# EAGLE board projekt_oswietlenia (EAGLE 8.5.2)
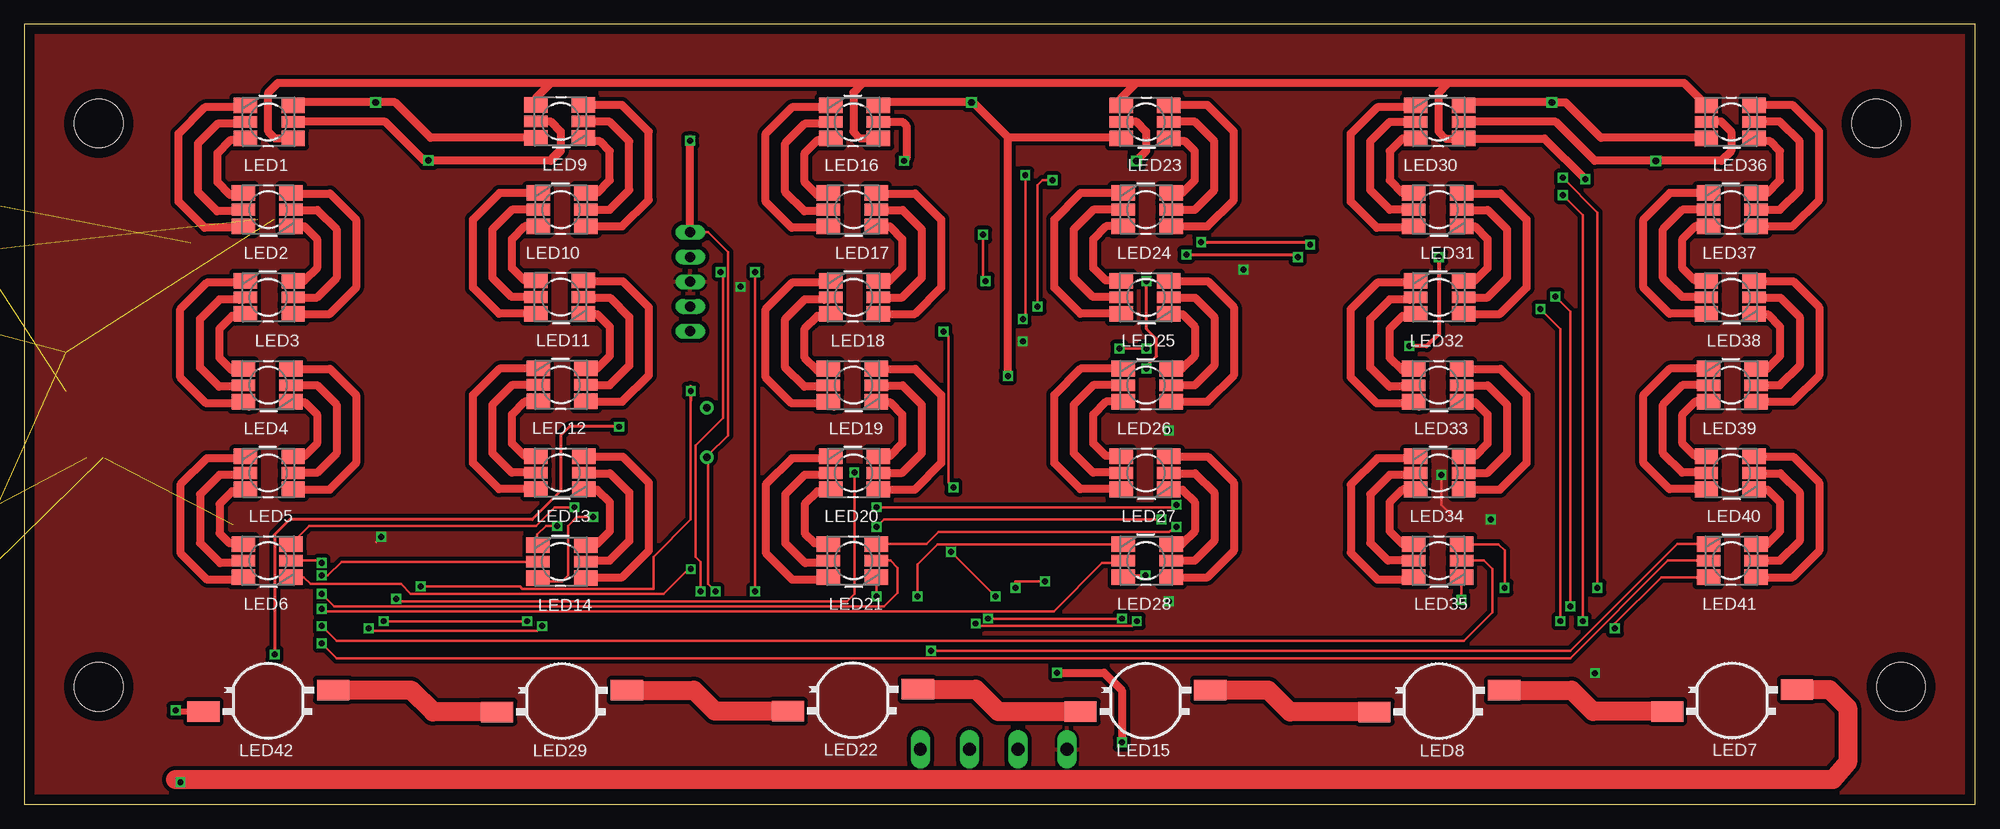
[diagram p3: board, top side]
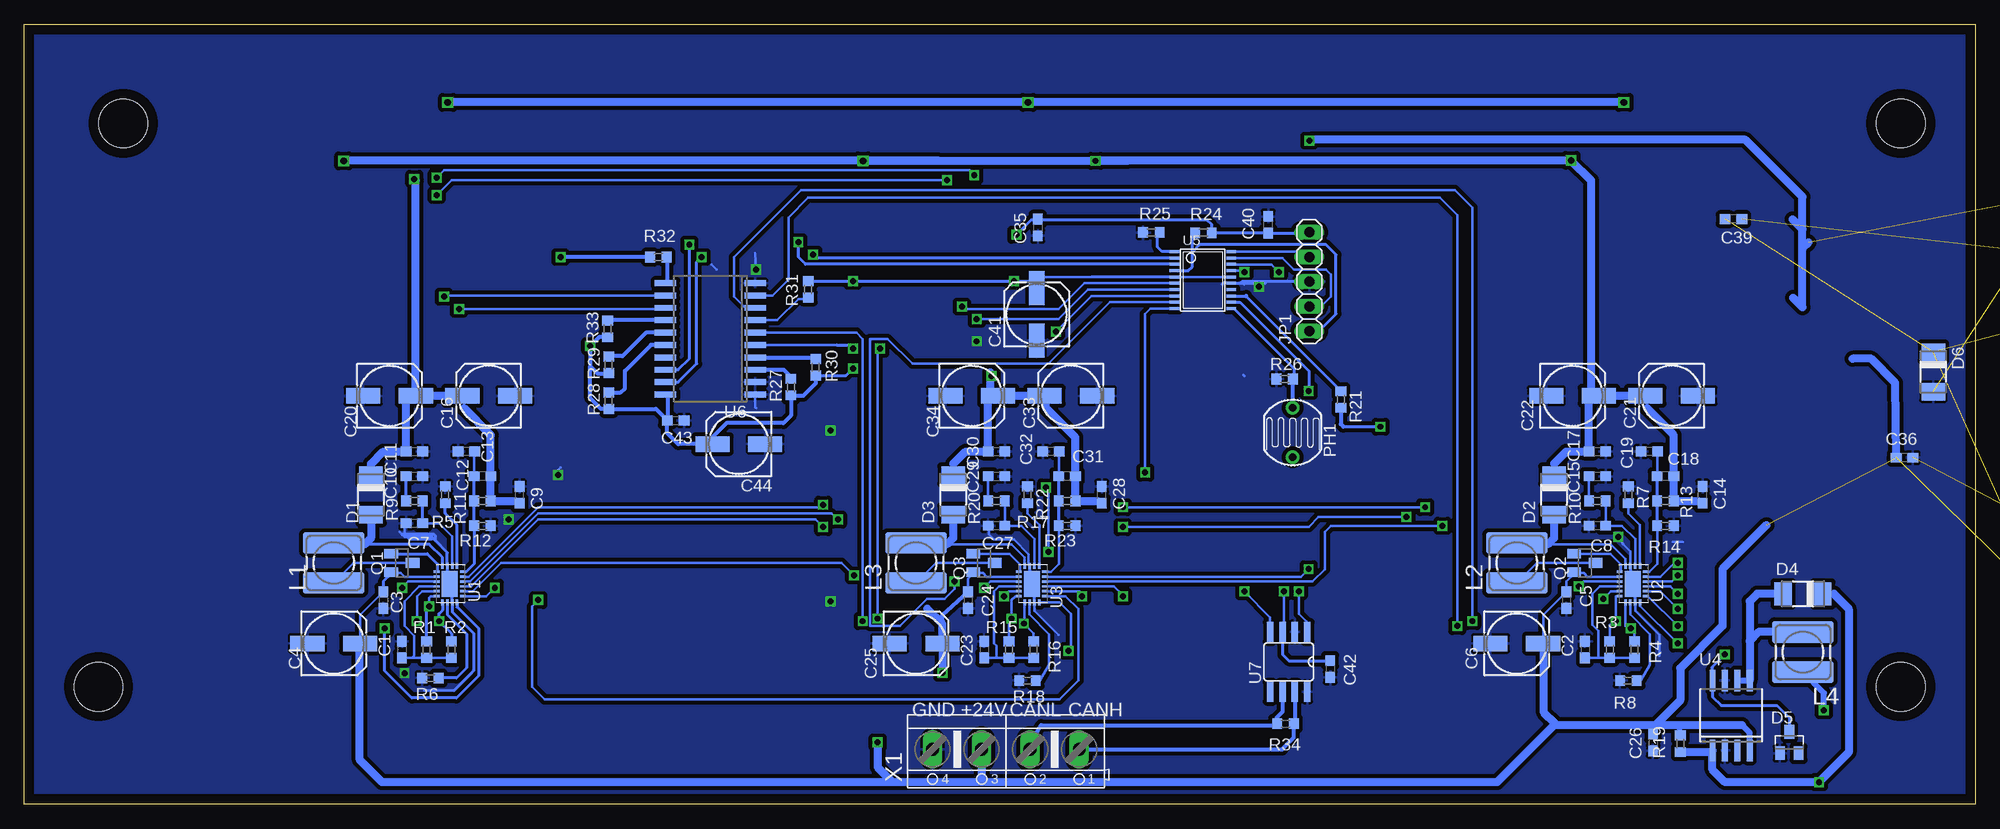
[diagram p4: board, bottom side, seen from below]

Size 200 x 80 mm. Coordinates in mm from the lower left corner, seen from the top.
Outline: 0,0 200,0 200,80 0,80 0,0
Copper layers (1*16): Top 0.035mm / dielectric 1.5mm / Bottom 0.035mm
Design rules "default *": minimum track width 9mil, minimum drill 24mil, track to track 6mil, track to pad 6mil, pad to pad 6mil, via to via 8mil, smd to smd 6mil, copper to edge 40mil, drill to drill 8mil, minimum pad ring 10mil, minimum via ring 8mil, stop-mask expansion 4mil, vias tented up to drill 0mil, thermal gap 10mil
Holes 5 mm at 7.62,69.85 7.62,12.06 192.41,12.06 189.87,69.85

## Footprints (pad centres in the part's own frame; a part is rotated, then mirrored left to right if it is on the bottom)
C0603 = smd 1.1 x 1: 1 -0.85,0; 2 0.85,0
153CLV-0605 = smd 3.5 x 1.6: + 2.7,0; - -2.7,0
DO-214AC = smd 1.8 x 2.4: A 2.025,0; C -2.025,0
SOT23 = smd 1 x 1.4: 1 -0.95,-1.1; 2 0.95,-1.1; 3 0,1.1
SMB = smd 2.4 x 2.4: A 2.2,0; C -2.2,0
SOT23-6 = smd 0.6 x 0.9: 1 -0.95,-1.15; 2 0,-1.15; 3 0.95,-1.15; 4 0.95,1.15; 5 0,1.15; 6 -0.95,1.15
1X05 = drill 1.016 long: 1 -5.08,0; 2 -2.54,0; 3 0,0; 4 2.54,0; 5 5.08,0
POWER-CHOKE_WE-TPC = smd 6.3 x 2.2: 1 0,2.05; 2 0,-2.05
MS50 = smd 2.8 x 1.4: 1 0,-1.7; 2 0,1.7
OVSTRGBBCR8 = smd 2.4 x 1.6: 1 2.342,-1.7; 3 2.342,1.7; 4 -2.558,1.7; 6 -2.558,-1.7 | smd 2.4 x 1.2: 2 2.342,0; 5 -2.558,0
Z-POWER-LED-DOME-TYPE = smd 3.3 x 2.1: A -6.65,-1.12; C 6.65,1.12
VT800 = drill 0.8 pad 1.4: 1 -2.54,0; 2 2.54,0
R0603 = smd 1 x 1.1: 1 -0.85,0; 2 0.85,0
QFN20 = smd 0.6 x 0.25: 1 -1.4,1.25; 2 -1.4,0.75; 3 -1.4,0.25; 4 -1.4,-0.25; 5 -1.4,-0.75; 6 -1.4,-1.25; 11 1.3,-1.25; 12 1.3,-0.75; 13 1.3,-0.25; 14 1.3,0.25; 15 1.3,0.75; 16 1.3,1.25 | smd 0.25 x 0.6: 7 -0.8,-1.9; 8 -0.3,-1.9; 9 0.2,-1.9; 10 0.7,-1.9; 17 0.7,1.85; 18 0.2,1.85; 19 -0.3,1.85; 20 -0.8,1.85 | smd 1.65 x 2.65: EPAD -0.05,0
SOP-08 = smd 0.6 x 2.2: 1 -1.905,-3.6; 2 -0.635,-3.6; 3 0.635,-3.6; 4 1.905,-3.6; 5 1.905,3.575; 6 0.635,3.575; 7 -0.635,3.575; 8 -1.905,3.575
TSSOP20 = smd 0.305 x 0.991: 1 -2.925,-2.918; 2 -2.275,-2.918; 3 -1.625,-2.918; 4 -0.975,-2.918; 5 -0.325,-2.918; 6 0.325,-2.918; 7 0.975,-2.918; 8 1.625,-2.918; 9 2.275,-2.918; 10 2.925,-2.918; 11 2.925,2.918; 12 2.275,2.918; 13 1.625,2.918; 14 0.975,2.918; 15 0.325,2.918; 16 -0.325,2.918; 17 -0.975,2.918; 18 -1.625,2.918; 19 -2.275,2.918; 20 -2.925,2.918
SO20W = smd 0.6 x 2.2: 1 -5.715,-4.6; 2 -4.445,-4.6; 3 -3.175,-4.6; 4 -1.905,-4.6; 5 -0.635,-4.6; 6 0.635,-4.6; 7 1.905,-4.6; 8 3.175,-4.6; 9 4.445,-4.6; 10 5.715,-4.6; 11 5.715,4.6; 12 4.445,4.6; 13 3.175,4.6; 14 1.905,4.6; 15 0.635,4.6; 16 -0.635,4.6; 17 -1.905,4.6; 18 -3.175,4.6; 19 -4.445,4.6; 20 -5.715,4.6
SO8 = smd 0.66 x 2.032: 1 -1.905,-3.073; 2 -0.635,-3.073; 3 0.635,-3.073; 4 1.905,-3.073; 5 1.905,3.073; 6 0.635,3.073; 7 -0.635,3.073; 8 -1.905,3.073
AK500/4 = drill 1.321 long: 1 -7.518,0; 2 -2.489,0; 3 2.489,0; 4 7.518,0

## Placement (x,y rotation side)
C1  100n  [C0603]  161.29,15.88 270 bottom
C2  100n  [C0603]  40.01,15.88 270 bottom
C3  100n  [C0603]  163.19,20.95 270 bottom
C4  10uF/50V  [153CLV-0605]  168.28,16.51 0 bottom
C5  100n  [C0603]  41.91,20.95 270 bottom
C6  10uF/50V  [153CLV-0605]  46.99,16.51 0 bottom
C7  3,3n  [C0603]  160.02,28.83 180 bottom
C8  3,3n  [C0603]  38.73,28.57 180 bottom
C9  100n  [C0603]  149.22,31.75 90 bottom
C10  390p  [C0603]  160.02,33.66 0 bottom
C11  100n  [C0603]  160.02,36.2 0 bottom
C12  33pF  [C0603]  153.03,33.66 180 bottom
C13  330p  [C0603]  154.69,36.2 180 bottom
C14  100n  [C0603]  27.94,31.75 90 bottom
C15  390p  [C0603]  38.73,33.66 0 bottom
C16  47uF/50V  [153CLV-0605]  152.4,41.91 180 bottom
C17  100n  [C0603]  38.73,36.2 0 bottom
C18  33pF  [C0603]  31.75,33.66 180 bottom
C19  470p  [C0603]  33.4,36.2 180 bottom
C20  47uF/50V  [153CLV-0605]  162.56,41.91 0 bottom
C21  47uF/50V  [153CLV-0605]  31.11,41.91 180 bottom
C22  47uF/50V  [153CLV-0605]  41.27,41.91 0 bottom
C23  100n  [C0603]  101.6,15.88 270 bottom
C24  100n  [C0603]  103.25,20.95 270 bottom
C25  10uF/50V  [153CLV-0605]  108.58,16.51 0 bottom
C26  4,7uF/50V  [C0603]  33.02,6.35 270 bottom
C27  3,3n  [C0603]  100.33,28.57 180 bottom
C28  100n  [C0603]  89.53,31.75 90 bottom
C29  390p  [C0603]  100.33,33.66 0 bottom
C30  100n  [C0603]  100.33,36.2 0 bottom
C31  33pF  [C0603]  93.09,33.66 180 bottom
C32  470p  [C0603]  94.74,36.2 180 bottom
C33  47uF/50V  [153CLV-0605]  92.71,41.91 180 bottom
C34  47uF/50V  [153CLV-0605]  102.87,41.91 0 bottom
C35  100n  [C0603]  96.1,59.17 270 bottom
C36  10 uF X7R  [C0603]  7.24,35.56 180 bottom
C37  10 uF X7R  [C0603]  -10,63 180 top  (outside the outline)
C38  10 uF X7R  [C0603]  -10,68 180 top  (outside the outline)
C39  100nF  [C0603]  24.78,60.02 180 bottom
C40  100n  [C0603]  72.47,59.45 90 bottom
C41  10uF/50V  [153CLV-0605]  96.22,50.26 90 bottom
C42  100n  [C0603]  66.12,13.89 270 bottom
C43  100n  [C0603]  133.22,39.37 0 bottom
C44  10uF/50V  [153CLV-0605]  126.75,36.96 180 bottom
D1  SS15  [DO-214AC]  164.47,31.75 270 bottom
D2  SS15  [DO-214AC]  43.18,31.75 270 bottom
D3  SS15  [DO-214AC]  104.78,31.75 270 bottom
D4  SS15  [DO-214AC]  17.65,21.59 180 bottom
D5  BAV70.215  [SOT23]  19.05,6.35 0 bottom
D6  SS15  [DO-214AC]  4.29,44.36 270 bottom
D7  1N4148  [SMB]  -14,56 180 top  (outside the outline)
IC1  MCP16301/H  [SOT23-6]  -9,20 180 top  (outside the outline)
JP1  1x5  [1X05]  68.26,53.61 90 bottom
L1  47uH/400mA  [POWER-CHOKE_WE-TPC]  168.28,24.77 180 bottom
L2  47uH/400mA  [POWER-CHOKE_WE-TPC]  46.99,24.77 180 bottom
L3  47uH/400mA  [POWER-CHOKE_WE-TPC]  108.58,24.77 180 bottom
L4  47uH/720mA  [POWER-CHOKE_WE-TPC]  17.65,15.62 0 bottom
L5  WLPN303015M150PB  [MS50]  -12,49 180 top  (outside the outline)
LED1  FYLS-5050NRGBC  [OVSTRGBBCR8]  25,70 180 top
LED2  FYLS-5050NRGBC  [OVSTRGBBCR8]  25,61 0 top
LED3  FYLS-5050NRGBC  [OVSTRGBBCR8]  25,52 180 top
LED4  FYLS-5050NRGBC  [OVSTRGBBCR8]  25,43 0 top
LED5  FYLS-5050NRGBC  [OVSTRGBBCR8]  25,34 180 top
LED6  FYLS-5050NRGBC  [OVSTRGBBCR8]  25,25 0 top
LED7  X42180  [Z-POWER-LED-DOME-TYPE]  175.08,10.65 180 top
LED8  X42180  [Z-POWER-LED-DOME-TYPE]  145.06,10.59 180 top
LED9  FYLS-5050NRGBC  [OVSTRGBBCR8]  54.98,70.06 0 top
LED10  FYLS-5050NRGBC  [OVSTRGBBCR8]  55.02,61 180 top
LED11  FYLS-5050NRGBC  [OVSTRGBBCR8]  54.98,52.03 0 top
LED12  FYLS-5050NRGBC  [OVSTRGBBCR8]  55.02,43.03 180 top
LED13  FYLS-5050NRGBC  [OVSTRGBBCR8]  55.01,34.01 0 top
LED14  FYLS-5050NRGBC  [OVSTRGBBCR8]  54.99,24.89 180 top
LED15  X42180  [Z-POWER-LED-DOME-TYPE]  114.93,10.62 180 top
LED16  FYLS-5050NRGBC  [OVSTRGBBCR8]  85,70 180 top
LED17  FYLS-5050NRGBC  [OVSTRGBBCR8]  85,61 0 top
LED18  FYLS-5050NRGBC  [OVSTRGBBCR8]  85,52 180 top
LED19  FYLS-5050NRGBC  [OVSTRGBBCR8]  85,43 0 top
LED20  FYLS-5050NRGBC  [OVSTRGBBCR8]  85,34 180 top
LED21  FYLS-5050NRGBC  [OVSTRGBBCR8]  85,25 0 top
LED22  X42180  [Z-POWER-LED-DOME-TYPE]  84.94,10.69 180 top
LED23  FYLS-5050NRGBC  [OVSTRGBBCR8]  115,70 0 top
LED24  FYLS-5050NRGBC  [OVSTRGBBCR8]  115,61 180 top
LED25  FYLS-5050NRGBC  [OVSTRGBBCR8]  115,52 0 top
LED26  FYLS-5050NRGBC  [OVSTRGBBCR8]  115,43 180 top
LED27  FYLS-5050NRGBC  [OVSTRGBBCR8]  115,34 0 top
LED28  FYLS-5050NRGBC  [OVSTRGBBCR8]  115,25 180 top
LED29  X42180  [Z-POWER-LED-DOME-TYPE]  55.11,10.6 180 top
LED30  FYLS-5050NRGBC  [OVSTRGBBCR8]  145,70 180 top
LED31  FYLS-5050NRGBC  [OVSTRGBBCR8]  145,61 0 top
LED32  FYLS-5050NRGBC  [OVSTRGBBCR8]  145,52 180 top
LED33  FYLS-5050NRGBC  [OVSTRGBBCR8]  145,43 0 top
LED34  FYLS-5050NRGBC  [OVSTRGBBCR8]  145,34 180 top
LED35  FYLS-5050NRGBC  [OVSTRGBBCR8]  145,25 0 top
LED36  FYLS-5050NRGBC  [OVSTRGBBCR8]  175,70 0 top
LED37  FYLS-5050NRGBC  [OVSTRGBBCR8]  175,61 180 top
LED38  FYLS-5050NRGBC  [OVSTRGBBCR8]  175,52 0 top
LED39  FYLS-5050NRGBC  [OVSTRGBBCR8]  175,43 180 top
LED40  FYLS-5050NRGBC  [OVSTRGBBCR8]  175,34 0 top
LED41  FYLS-5050NRGBC  [OVSTRGBBCR8]  175,25 180 top
LED42  X42180  [Z-POWER-LED-DOME-TYPE]  25,10.62 180 top
PH1  PGM5537  [VT800]  69.96,38.14 90 bottom
Q1  BSS314  [SOT23]  161.29,24.77 270 bottom
Q2  BSS314  [SOT23]  40.01,24.77 270 bottom
Q3  BSS314  [SOT23]  101.6,24.77 270 bottom
R1  4k7  [R0603]  158.75,15.88 270 bottom
R2  4k7  [R0603]  156.21,15.88 270 bottom
R3  4k7  [R0603]  37.47,15.88 270 bottom
R4  4k7  [R0603]  34.92,15.88 270 bottom
R5  20k 0.1%  [R0603]  156.84,31.75 270 bottom
R6  68k  [R0603]  158.37,12.95 0 bottom
R7  20k 0.1%  [R0603]  35.56,31.75 270 bottom
R8  68k  [R0603]  35.56,12.7 0 bottom
R9  10k  [R0603]  160.02,31.11 0 bottom
R10  10k  [R0603]  38.73,31.11 0 bottom
R11  1M  [R0603]  153.03,31.11 0 bottom
R12  100k  [R0603]  153.03,28.57 180 bottom
R13  1M  [R0603]  31.75,31.11 0 bottom
R14  68k  [R0603]  31.75,28.57 180 bottom
R15  4k7  [R0603]  99.06,15.88 270 bottom
R16  4k7  [R0603]  96.52,15.88 270 bottom
R17  20k 0.1%  [R0603]  97.16,31.75 270 bottom
R18  68k  [R0603]  97.16,12.7 0 bottom
R19  0,56R 1%  [R0603]  30.23,6.22 90 bottom
R20  10k  [R0603]  100.33,31.11 0 bottom
R21  3k3  [R0603]  65.02,41.53 270 bottom
R22  1M  [R0603]  93.09,31.11 0 bottom
R23  68k  [R0603]  93.09,28.57 180 bottom
R24  10k  [R0603]  79.11,58.63 0 bottom
R25  0R  [R0603]  84.46,58.66 0 bottom
R26  10k  [R0603]  70.78,43.63 0 bottom
R27  4k7  [R0603]  121.41,42.8 90 bottom
R28  4k7  [R0603]  140.08,41.4 90 bottom
R29  4k7  [R0603]  140.08,45.09 90 bottom
R30  4k7  [R0603]  118.87,44.83 90 bottom
R31  4k7  [R0603]  119.63,52.83 270 bottom
R32  4k7  [R0603]  135,56.13 0 bottom
R33  4k7  [R0603]  140.21,48.77 90 bottom
R34  4k7  [R0603]  70.7,8.29 180 bottom
R35  10k  [R0603]  -9,27 180 top  (outside the outline)
R36  31k2  [R0603]  -9,33 180 top  (outside the outline)
U1  ISL97671A  [QFN20]  156.34,22.61 0 bottom
U2  ISL97671A  [QFN20]  35.05,22.61 0 bottom
U3  ISL97671A  [QFN20]  96.65,22.61 0 bottom
U4  AP8801  [SOP-08]  25.02,9.14 0 bottom
U5  STM32F042FXPX  [TSSOP20]  79.17,53.77 270 bottom
U6  PCA9545  [SO20W]  129.67,47.75 90 bottom
U7  SN65HVD230/1  [SO8]  70.38,14.62 180 bottom
X1  ARK R=5  [AK500/4]  99.37,5.64 180 bottom

## Tracks (layer width: path | path; a pad name or v marks a point on that pad's centre or on a via)
+3V3  (via drill 0.61)  (5 unrouted)
  Top 0.254: v98.3,58.42 98.3,53.94 v98.55,53.68 | JP1.5 68.58,58.67 70.1,58.67 72.14,56.64 72.14,37.85 70.1,35.81 PH1.1 70.1,35.56 70.1,22.61 v70.87,21.84
  Top 0.305: v115.06,44.7 115.06,44.96 116.08,45.97 116.08,47.75 115.06,48.77 v115.06,53.68
  Top 0.406: v145.03,56.13 145.03,48.26 143.76,46.99 v141.99,46.99
  Top 0.813: JP1.5 v68.26,68.07 68.26,68.26
  Bottom 0.254: 90.59,54.1 96.28,54.1 96.69,53.68 | C35.1 96.19,60.02 96.27,59.94 | U5.16 76.45,54.1 82.04,54.1 U5.5 | v70.87,21.84 70.87,17.78 U7.3
  Bottom 0.305: 129.54,37.59 129.54,37.05 | JP1.5 68.35,58.6 C40.1 78.23,58.6 R24.2 78.26,59.46 78.74,59.94 96.27,59.94 96.77,59.94 v98.3,58.42 | U7.3 71.01,15.39 70.36,14.73 C42.1 | U5.5 90.59,54.1 | R31.1 v115.06,53.68 v98.55,53.68 96.69,53.68 C41.+ | R30.1 115.78,43.98 v115.06,44.7
  Bottom 0.406: C43.1 134.07,41.84 U6.20 134.14,41.91 133.35,41.91 | C43.1 134.11,39.33 134.11,38.1 132.97,36.96 C44.+ 129.54,37.05 | R33.1 141.06,47.92 v141.99,46.99 141.99,44.96 | 141.99,44.96 141.22,44.2 140.12,44.2 R29.1 | 141.99,44.96 141.99,41.66 140.88,40.55 R28.1 135.25,40.55 C43.1 | R32.1 v145.03,56.13 | 129.54,37.59 128.02,39.12 122.17,39.12 121.41,39.88 R27.1 121.37,41.91 120.14,41.91 118.87,43.18 R30.1
  Bottom 0.813: v68.26,68.07 68.16,68.17 23.55,68.17 17.7,62.33 17.7,59 | 17.7,57 17.7,51 18.65,51.94 | 17.7,57 17.7,59 | 18.73,60.02 17.7,59 | 17.07,57.63 17.7,57
+24V  (via drill 0.61)  (3 unrouted)
  Top 0.813: v105.89,13.49 110.71,13.49 112.52,11.68 v112.52,6.35
  Bottom 0.254: U2.2 39.74,23.36 40.13,23.75 41.04,23.75 Q2.2 41.1,23.66 41.91,22.86 C5.1 44.29,19.43 C6.+ | U1.2 161.02,23.36 161.42,23.75 162.32,23.75 Q1.2 162.39,23.66 | C4.+ 165.57,19.43 C3.1 | U3.2 101.33,23.36 101.73,23.75 102.63,23.75 Q3.2 102.7,23.66 103.25,23.11 C24.1
  Bottom 0.305: 162.39,23.66 163.19,22.86 C3.1
  Bottom 0.406: R19.2 30.23,7.62 30.73,8.13 | 105.89,18.51 105.89,19.43 C24.1 | C26.1 33.02,8.13
  Bottom 0.61: U4.4 23.11,7.37 23.88,8.13 | 42.93,8.13 43.05,8.26 | 44.2,16.42 C6.+
  Bottom 0.813: 23.88,8.13 30.73,8.13 32.77,8.13 | 32.77,8.13 33.02,8.13 42.93,8.13 | 44.2,16.42 44.2,9.4 43.05,8.26 49.02,2.29 102.11,2.29 | 8.26,35.49 C36.2 8.19,43.24 10.67,45.72 12.55,45.72 | 21.39,28.65 25.91,24.13 25.91,18.29 30.23,13.97 30.23,10.67 32.77,8.13 | 102.11,2.29 111,2.29 | 111,2.29 163.32,2.29 165.61,4.57 165.61,16.48 C4.+ | X1.3 101.86,2.53 102.11,2.29 | 107.44,20.07 105.89,18.51 C25.+ v105.89,13.49 105.92,13.46 | v112.52,6.35 112.52,3.81 111,2.29
ADC7
  Bottom 0.305: U5.11 76,50.85 69.85,44.7 69.85,43.71 R26.2
  Bottom 0.406: PH1.2 69.96,43.6 R26.2
B1  (via drill 0.61)
  Top 0.254: LED41.1 169.45,26.7 158.5,15.75 v92.96,15.75
  Bottom 0.254: U3.10 93.86,20.71 92.71,19.56 92.71,16 v92.96,15.75
B2  (via drill 0.61)
  Top 0.254: v147.32,20.95 147.32,23.28 LED35.1
  Bottom 0.254: U3.11 93.24,21.36 91.95,20.07 91.95,12.7 93.85,10.79 146.69,10.79 147.96,12.06 147.96,20.32 v147.32,20.95
B3  (via drill 0.61)
  Top 0.254: v91.57,21.34 91.57,24.64 93.6,26.67 112.63,26.67 LED28.1
  Bottom 0.254: U3.12 91.83,21.86 v91.57,21.34
B4  (via drill 0.61)
  Top 0.254: 87.25,23.24 87.63,22.86 | 87.63,22.86 87.63,23.01 LED21.1 | v87.38,21.34 87.38,22.61 87.63,22.86
  Bottom 0.254: U3.13 88.27,22.36 87.38,21.46 v87.38,21.34
B5  (via drill 0.61)
  Top 0.254: 52.65,26.61 LED14.1 52.58,26.66 52.58,27.69 53.47,28.57 v54.61,28.57
  Bottom 0.254: U3.14 67.94,22.86 66.67,24.13 66.67,27.94 66.04,28.57 v54.61,28.57
B6  (via drill 0.61)
  Top 0.254: LED6.1 28.64,23.3 29.34,22.61 38.61,22.61 39.62,21.59 65.53,21.59 68.07,24.13 v68.33,24.13
  Bottom 0.254: U3.15 69.1,23.36 v68.33,24.13
B+  (via drill 0.61, 0.7)
  Top 0.254: 112.43,68.36 112.43,68.31 LED23.6 | 172.43,68.36 172.43,68.31 LED36.6
  Top 0.813: LED1.6 27.86,72 v36,72 38,72 41.65,68.36 LED9.6 | 112.43,68.36 100.88,68.36 | 100.88,68.36 97.24,72 v97.1,72 88,72 | 88,72 87.86,72 LED16.6 87.7,71.7 88,72 | 172.43,68.36 161.65,68.36 158,72 v156.59,72 147.86,72 LED30.6 | v100.84,43.94 100.84,68.31 100.88,68.36
  Bottom 0.254: 89.95,31.11 C28.1 | D3.C 104.78,34.92 | 101.18,41.7 100.97,41.91 C34.+
  Bottom 0.813: v36,72 v97.1,72 v156.59,72 | 89.95,31.11 R22.2 C31.1 92.24,37.63 95.25,40.64 95.25,41.75 C33.+ C34.+ | 104.78,34.92 103.5,36.2 C30.1 101.18,41.7 | 100.97,41.91 100.97,44.32 v100.84,43.94
CAN_RX  (via drill 0.61)
  Top 0.254: v74.93,21.84 v74.93,54.61
  Bottom 0.254: v74.93,21.84 72.28,19.2 U7.4 | U5.17 75.07,54.75 v74.93,54.61
CAN_TX  (via drill 0.61)
  Top 0.254: v71.37,54.61 71.63,54.36 71.63,39.62 68.83,36.83 68.83,25.4 69.34,24.89 v69.34,21.84
  Bottom 0.254: v69.34,21.84 69.34,19.56 68.58,18.8 68.58,17.78 U7.1 | U5.18 76.2,55.37 72.14,55.37 v71.37,54.61
CANH
  Bottom 0.406: X1.1 71.06,5.64 69.85,6.86 69.85,8.03 R34.1 69.74,7.88 U7.7
CANL
  Bottom 0.254: 71.96,8.13 71.88,8.13 71.63,8.38 71.63,8.89
  Bottom 0.406: U7.6 71.01,9.51 71.63,8.89 | X1.2 96.88,6.24 95.76,8.13 71.96,8.13 R34.2
EN1  (via drill 0.61)
  Top 0.254: v161.29,22.23 161.29,60.71 v157.73,64.26 | v102.62,64.52 102.62,50.29 v102.36,49.78
  Bottom 0.254: v161.29,22.23 160.66,22.86 160.65,22.86 U1.3 | v102.36,49.78 93.98,49.78 90.97,52.8 U5.7 | v157.73,64.26 156.97,65.02 103.12,65.02 v102.62,64.52
EN2  (via drill 0.61)
  Top 0.254: v40.64,22.35 50.8,22.35 51.05,22.1 64.52,22.1 64.52,25.4 68.33,29.21 68.33,41.4 | 68.33,42.93 v68.33,42.42
  Top 0.305: v68.33,42.42 68.33,41.4
  Bottom 0.254: v40.64,22.35 40.13,22.86 36.58,22.86 U2.3
  Bottom 0.305: U5.12 75.38,51.5 68.33,44.45 v68.33,42.42
EN3  (via drill 0.61)
  Top 0.254: v104.65,22.86 101.6,22.86 v101.6,22.23
  Bottom 0.254: U3.3 100.97,22.86 v101.6,22.23 | v104.65,22.86 104.65,22.1 105.66,21.08 107.44,21.08 110.24,18.29 113.28,18.29 113.28,47.75 111.51,47.75 108.97,45.21 95,45.21 88.71,51.5 U5.9
G1  (via drill 0.61)
  Top 0.254: LED41.2 168.51,25 158.5,14.99 32,14.99 v30.48,16.51
  Bottom 0.254: U2.10 34.35,20.38 v30.48,16.51
G2  (via drill 0.61)
  Top 0.254: LED35.2 149.62,25 150.5,24.13 150.5,19.68 147.57,16.76 32,16.76 v30.48,18.29
  Bottom 0.254: U2.11 33.55,21.36 v30.48,18.29
G3  (via drill 0.61)
  Top 0.254: LED28.2 112.42,24.77 110.49,24.77 105.54,19.81 30.73,19.81 v30.48,20.07
  Bottom 0.254: U2.12 32.27,21.86 v30.48,20.07
G4  (via drill 0.61)
  Top 0.254: LED21.2 88.79,25 89.53,24.26 89.53,21.72 88.14,20.32 31.75,20.32 v30.48,21.59
  Bottom 0.254: U2.13 31.25,22.36 v30.48,21.59
G5  (via drill 0.61)
  Top 0.254: LED14.2 32.51,24.89 31.11,23.5 v30.48,23.5
  Bottom 0.254: U2.14 31.11,22.86 v30.48,23.5
G6  (via drill 0.61)
  Top 0.254: LED6.2 30.25,25 v30.48,24.77
  Bottom 0.254: U2.15 32.27,23.36 30.86,24.77 v30.48,24.77
G+  (via drill 0.61, 0.7)
  Top 0.254: LED23.5 112.44,70.04 112.43,70.06 | 172.43,70.06 172.43,70.19 172.72,70.48 172.72,70.28 LED36.5
  Top 0.813: LED9.5 53.95,70.06 55,69 55,67.32 | LED1.5 37,70 41,66 54,66 55,67 55,67.32 | 112.43,70.06 113.94,70.06 115,69 115,67 114,66 v114.02,66 | 172.43,70.06 173.94,70.06 175,69 175,67 174,66 v167.26,66 161,66 157,70 LED30.5 | 55,67.32 54.99,67.31 54.99,67.16 54.13,66.29 54.13,66.24 53.92,66.04 v41.43,66.04 | LED16.5 90.02,70 90.42,69.6 90.42,66.25 v90.17,66
  Bottom 0.254: 28.36,31.11 C14.1 | D2.C 43.18,34.92 | 39.59,41.7 39.37,41.91 C22.+ | 33.66,40.64 33.66,41.75 C21.+
  Bottom 0.813: v114.02,66 v90.17,66 | v90.17,66 89.45,66 89.41,66.04 | 106.36,66.04 v114.02,66 | v114.02,66 v167.26,66 | 28.36,31.11 R13.2 C18.1 30.9,37.88 33.66,40.64 | C21.+ C22.+ | 43.18,34.92 41.91,36.2 C17.1 39.59,41.7 | 39.37,41.91 39.37,63.98 v41.43,66.04 86.87,66.04 | 86.87,66.04 89.41,66.04 | 89.41,66.04 89.92,66.04 | v90.17,66 86.91,66 86.87,66.04
GND  (via drill 0.61)  (4 unrouted)
  Top 0.254: 146.3,29.72 145.29,30.73 v145.29,33.78 | 36.07,26.92 v36.58,27.43
  Bottom 0.254: 34.85,20.39 34.85,19.87 32.38,17.4 32.38,15.24 | 96.45,20.39 96.45,19.87 93.98,17.4 | 75.04,44.05 74.93,43.94 | C7.2 161.04,28.41 161.04,27.69 160.53,27.18 158.24,27.18 158.24,27.43 161.04,27.43 161.29,27.69 161.54,27.94 | 155.96,11.68 159,11.68 | v145.29,33.78 145.29,34.29 145.03,34.54 | 125.07,56.54 v124.97,54.86 | 129.03,54.86 129.54,55.37 | U2.19 35.35,25.95 36.07,26.67 v36.58,27.43 | 30.99,26.92 29.97,26.92 | U6.1 125.07,40.74 124.97,40.64 | U3.19 97.03,24.64 97.03,25.65 98.55,27.18 100.58,27.18 101.09,27.69 101.09,28.49 C27.2
  Bottom 0.305: U2.19 35.35,22.86 U2.EPAD 34.85,22.36 U2.9 34.85,20.39 | U3.19 96.95,22.86 U3.EPAD 96.45,22.36 U3.9 96.45,20.39 | 155.96,11.68 153.92,13.72 153.92,17.53 156.14,19.74 U1.9 156.14,22.36 U1.EPAD 156.64,22.86 U1.19 156.64,25.83 157.86,27.05 | 77.22,53.34 77.11,53.45 U5.15 72.79,53.45 72.64,53.59 | JP1.3 75.17,53.61 75.18,53.59 74.93,53.34 | 157.86,27.05 158.24,27.43 | 157.86,27.05 157.86,27.56 157.99,27.69 161.29,27.69
  other vias: 150.37,29.21 102.36,47.5 161.04,13.46 117.35,20.83 117.35,38.35 73.41,53.09
  pour Bottom (isolate 0.406): -1.27,81.92 202.56,81.92 202.69,-2.92 -1.14,-2.92
  pour Top (isolate 0.406): 0.03,80 0.03,0 200,0 200,80
N$1
  Top 0.813: LED14.4 57.43,23.19 57.32,23.3 61.3,23.3 64,26 64,33 61.34,35.66 57.4,35.66 LED13.3
N$2
  Top 0.813: 57.44,25 60,25 62,27 62,32 60.03,33.97 57.4,33.97 LED13.2 | 57.32,25 57.44,25 | 57.44,25 LED14.5
N$3
  Top 0.254: 58.73,32.27 57.4,32.27 LED13.1
  Top 0.813: 58.73,32.27 60,31 60,28 58.7,26.7 57.44,26.7 | 57.32,26.7 57.44,26.7 | 57.44,26.7 LED14.6
N$4
  Top 0.813: LED13.4 52.43,35.73 51.27,35.73 50,37 50,40 51.3,41.3 52.68,41.3 LED12.3
N$5
  Top 0.813: LED13.5 52.43,34.03 49.97,34.03 48,36 48,41 50,43 52.68,43 LED12.2
N$6
  Top 0.813: LED13.6 52.43,32.34 48.66,32.34 46,35 46,42 48.7,44.7 52.68,44.7 LED12.1
N$7
  Top 0.813: 57.32,44.7 58,44.7 | 58,44.7 58.7,44.7 60,46 60,49 58.73,50.27 57.58,50.27 57.51,50.34 LED11.1 | LED12.6 57.97,44.73 58,44.7
N$8
  Top 0.813: 57.58,51.97 58,51.97 | 58,51.97 60.03,51.97 62,50 62,45 60,43 58,43 | 57.32,43 58,43 | LED12.5 57.97,43.03 58,43 | LED11.2 57.93,52.03 58,51.97
N$9
  Top 0.813: 57,54 57.27,53.73 LED11.3 57.51,53.73 57.58,53.66 61.34,53.66 64,51 64,44 61.3,41.3 57.55,41.3 | 57.32,41.3 57.55,41.3 | 57.55,41.3 LED12.4
N$10
  Top 0.813: LED11.4 51.27,53.73 50,55 50,58 51.3,59.3 LED10.3
N$11
  Top 0.813: LED11.5 49.97,52.03 48,54 48,59 50,61 LED10.2
N$12
  Top 1.93: LED29.C 41.88,9.48 39.62,11.74 LED42.A
N$13
  Top 0.813: LED11.6 48.66,50.34 46,53 46,60 48.7,62.7 LED10.1
N$14
  Top 0.813: LED10.4 61.3,59.3 64,62 64,69 61.24,71.75 LED9.3
N$15
  Top 0.813: LED10.5 60,61 62,63 62,68 59.95,70.06 LED9.2
N$16
  Top 0.813: LED10.6 58.7,62.7 60,64 60,67 59,68 57.68,68 LED9.1
N$17
  Top 0.813: 22.44,26.68 22.32,26.8 21,26.8 20,27.8 20,30.8 21.3,32.1 22.42,32.1 22.62,32.3 LED5.3 | LED6.4 22.44,26.68 | 22.44,26.68 22.67,26.45
N$18
  Top 0.813: LED6.5 22.67,24.77 22.67,24.75 20.05,24.75 18,26.8 18,31.8 20,33.8 22.46,33.8 LED5.2
N$19
  Top 0.813: LED6.6 22.67,23.07 22.67,23.05 18.75,23.05 16,25.8 16,32.8 18.7,35.5 22.46,35.5 LED5.1
N$20
  Top 0.813: LED5.4 27.32,32.3 27.43,32.19 27.55,32.19 27.55,32.29 LED5.4 | LED5.4 31.3,32.3 34,35 34,42 31.34,44.66 27.4,44.66 27.35,44.71 LED4.3
N$21
  Top 0.813: 27.44,34 LED5.5 30,34 32,36 32,41 30,43 LED4.2 | 27.32,34 27.44,34 | 27.44,34 27.55,33.89
N$22
  Top 0.813: 27.44,35.7 LED5.6 28.7,35.7 30,37 30,40 28.73,41.27 27.38,41.27 LED4.1 | 27.32,35.7 27.44,35.7 | 27.44,35.7 27.55,35.59
N$23
  Top 0.813: 23,40.8 22.73,41.06 22.49,41.06 22.42,41.13 | 22.42,41.13 18.66,41.13 16,43.8 16,50.8 18.7,53.5 22.45,53.5 | 22.45,53.5 22.68,53.5 22.68,53.68 LED3.1 | 22.45,53.5 22.42,53.47 | 22.42,41.13 22.42,41.28 LED4.6
N$24
  Top 0.813: 22,42.84 22.42,42.84 22.42,42.98 LED4.5 | 22,42.84 19.96,42.84 18,44.8 18,49.8 20,51.8 22,51.8 | 22,51.8 22.68,51.8 22.68,51.98 LED3.2 | 22.42,51.77 22.03,51.77 22,51.8 | 22.68,42.77 22.07,42.77 22,42.84
N$25
  Top 0.813: 22.42,44.53 21.27,44.53 20,45.8 20,48.8 21.3,50.1 22,50.1 | 22,50.1 22.68,50.1 22.66,50.12 LED3.3 | 22.42,50.07 22.03,50.07 22,50.1 | 22.68,44.47 22.49,44.47 22.42,44.53 | 22.42,44.53 22.42,44.68 LED4.4
N$26
  Top 0.813: 27.27,62.73 27,63 | 27.55,50.3 LED3.4 31.3,50.3 34,53 34,60 31.34,62.66 27.58,62.66 27.51,62.73 27.27,62.73 | 27.32,50.3 27.55,50.3 | 27.55,50.3 27.58,50.33 | LED2.3 27.3,62.7 27.27,62.73
N$27
  Top 0.813: 27.58,60.97 28,60.97 | 28,60.97 30.04,60.97 32,59 32,54 30,52 28,52 | 27.32,52 LED3.5 | LED3.5 28,52 | 28,52 27.97,52.03 27.58,52.03 27.58,52.02 LED3.5 | 28,60.97 27.93,61.03 27.32,61.03 27.34,61.02 LED2.2
N$28
  Top 0.813: 27.32,53.7 LED3.6 | LED3.6 28,53.7 | 28,53.7 28.7,53.7 30,55 30,58 28.73,59.27 27.58,59.27 27.51,59.34 27.32,59.34 27.34,59.31 LED2.1 | 28,53.7 27.97,53.73 27.58,53.73 27.58,53.72 LED3.6
N$29
  Top 0.813: 22.36,68.1 21.1,68.1 19.8,66.8 19.8,63.8 21.07,62.53 22.22,62.53 22.39,62.7 LED2.4 | 22.36,68.1 22.48,68.1 22.66,68.28 LED1.3 | 22.36,68.1 22.25,68.21
N$30
  Top 0.813: 22,60.84 22.4,60.84 22.45,60.79 | 22,60.84 19.77,60.84 17.8,62.8 17.8,67.8 19.8,69.8 22.36,69.8 | 22.36,69.8 22.48,69.8 22.48,69.82 LED1.2 | 22.36,69.8 22.25,69.91 | LED2.5 22,61 22,60.84
N$31
  Top 0.813: 22.4,59.13 18.46,59.13 15.8,61.8 15.8,68.8 18.5,71.5 22.48,71.5 | 22.25,71.61 22.37,71.61 22.48,71.5 | 22.4,59.13 22.45,59.09 | 22.4,59.13 22.4,59.26 LED2.6 | 22.48,71.5 22.48,71.52 LED1.1
N$32
  Top 0.813: LED28.4 117.32,23.3 117.43,23.19 117.55,23.19 117.55,23.29 LED28.4 | LED28.4 121.3,23.3 124,26 124,33 121.33,35.66 117.4,35.66 117.35,35.71 LED27.3
N$33
  Top 0.813: 117.32,25 117.44,25 | 117.44,25 117.55,24.89 | 117.44,25 LED28.5 120,25 122,27 122,32 120.03,33.97 117.4,33.97 117.35,34.01 LED27.2
N$34
  Top 0.813: 117.44,26.7 LED28.6 118.7,26.7 120,28 120,31 118.73,32.27 117.58,32.27 117.31,32 117,32 117.3,32.3 LED27.1 | 117.32,26.7 117.44,26.7 | 117.44,26.7 117.55,26.59
N$35
  Top 0.813: LED26.3 111.6,41.3 | 111.6,41.3 110.9,41.3 109.6,40 109.6,37 110.86,35.73 112.02,35.73 112.09,35.66 112.28,35.66 112.61,36 113,36 112.7,35.7 LED27.4 | 112.02,41.27 111.63,41.27 111.6,41.3
N$36
  Top 0.813: 112.02,34.03 111.6,34.03 | 111.6,34.03 109.56,34.03 107.6,36 107.6,41 109.6,43 111.6,43 | LED26.2 111.6,43 | 112.02,42.97 111.63,42.97 111.6,43 | 111.6,34.03 111.67,33.97 112.28,33.97 112.31,34 LED27.5
N$37
  Top 0.813: 112.33,32.27 112.6,32 | 112.05,44.7 108.3,44.7 105.6,42 105.6,35 108.27,32.34 112.02,32.34 112.09,32.27 112.33,32.27 | 112.05,44.7 112.02,44.67 | 112.33,32.27 112.41,32.27 LED27.6 | LED26.1 112.05,44.7
N$38
  Top 0.254: 117.58,44.73 117.58,44.72 LED26.6
  Top 0.813: 117.32,44.7 LED26.6 118,44.7 | 118,44.7 118.7,44.7 120,46 120,49 118.73,50.27 117.58,50.27 117.51,50.34 117.32,50.34 117.34,50.31 LED25.1 | 117.58,44.73 117.97,44.73 118,44.7
N$39
  Top 0.254: 117.58,43.03 117.58,43.02 LED26.5
  Top 0.813: 117.58,51.97 118,51.97 | 118,51.97 120.03,51.97 122,50 122,45 120,43 118,43 | 117.32,43 LED26.5 118,43 | 117.58,43.03 117.97,43.03 118,43 | 118,51.97 117.93,52.03 117.32,52.03 117.34,52.02 LED25.2
N$40
  Top 0.254: LED26.4 117.47,41.3
  Top 0.813: 117.27,53.73 117,54 | 117.55,41.3 LED26.4 121.3,41.3 124,44 124,51 121.33,53.66 117.58,53.66 117.51,53.73 117.27,53.73 | 117.32,41.3 117.47,41.3 117.55,41.3 | 117.55,41.3 117.58,41.33 | LED25.3 117.3,53.7 117.27,53.73
N$41
  Top 0.813: 112.16,59.3 110.9,59.3 109.6,58 109.6,55 110.86,53.73 112.02,53.73 112.29,54 113,54 112.7,53.7 LED25.4 | 112.16,59.3 112.05,59.41 | 112.16,59.3 LED24.3 | LED24.3 112.7,59.3 113,59 112.96,59 LED24.3
N$42
  Top 0.813: 112.16,61 109.6,61 107.6,59 107.6,54 109.56,52.03 112.2,52.03 112.25,51.99 112.26,52 LED25.5 | 112.16,61 112.05,61.11 | LED24.2 112.16,61
N$43
  Top 0.813: 112.28,62.7 108.3,62.7 105.6,60 105.6,53 108.27,50.34 112.2,50.34 112.25,50.29 LED25.6 | 112.05,62.81 112.17,62.81 112.28,62.7 | 112.28,62.7 LED24.1
N$44
  Top 0.813: LED24.4 121.3,59.3 124,62 124,69 121.25,71.75 117.33,71.75 117.33,71.72 LED23.3
N$45
  Top 0.813: LED24.5 120,61 122,63 122,68 119.94,70.06 117.33,70.06 117.33,70.02 LED23.2
N$46
  Top 0.813: LED24.6 118.7,62.7 120,64 120,67 119,68 117.68,68 117.34,68.34 | LED23.1 117.34,68.34 | 117.34,68.34 117.33,68.36
N$47
  Top 0.813: 82,26.8 81,26.8 80,27.8 80,30.8 81.3,32.1 82.42,32.1 82.62,32.3 LED20.3 | 82,26.8 82.32,26.8 82.67,26.45 | LED21.4 82.1,26.7 82,26.8
N$48
  Top 0.813: LED21.5 82.44,24.98 82.67,24.75 80.06,24.75 78,26.8 78,31.8 80,33.8 82.42,33.8 82.62,34 LED20.2
N$49
  Top 0.813: LED21.6 82.44,23.27 82.67,23.05 78.75,23.05 76,25.8 76,32.8 78.7,35.5 82.42,35.5 82.92,36 83,36 82.7,35.7 LED20.1
N$50
  Top 0.813: 87.55,32.19 87.43,32.19 87.32,32.3 LED20.4 91.3,32.3 94,35 94,42 91.33,44.66 87.4,44.66 87.35,44.71 LED19.3
N$51
  Top 0.813: 87.32,34 87.44,34 | 87.44,34 87.55,33.89 | 87.44,34 LED20.5 90,34 92,36 92,41 90.03,42.97 87.4,42.97 87.35,43.01 LED19.2
N$52
  Top 0.813: 87.7,35.7 88.7,35.7 90,37 90,40 88.73,41.27 87.58,41.27 87.54,41.3 LED19.1 | 87.32,35.7 87.44,35.7 | 87.44,35.7 87.55,35.59 | 87.44,35.7 LED20.6 | LED20.6 87.7,35.7 | 87.7,35.7 88,36 87.86,36 LED20.6
N$53
  Top 0.813: 83,40.8 82.73,41.06 82.49,41.06 82.42,41.13 82,41.13 | 82,41.13 78.67,41.13 76,43.8 76,50.8 78.7,53.5 82.45,53.5 | 82.45,53.5 82.68,53.5 82.68,53.68 LED18.1 | 82.45,53.5 82.42,53.47 | LED19.6 82.17,41.3 82,41.13
N$54
  Top 0.813: 82.42,42.84 82,42.84 | 82,42.84 79.97,42.84 78,44.8 78,49.8 80,51.8 82,51.8 | 82,51.8 82.68,51.8 82.68,51.98 LED18.2 | 82.42,51.77 82.03,51.77 82,51.8 | 82,42.84 82.07,42.77 82.68,42.77 LED19.5
N$55
  Top 0.813: 82.42,44.53 81.27,44.53 80,45.8 80,48.8 81.3,50.1 82,50.1 | 82,50.1 82.68,50.1 82.68,50.28 LED18.3 | 82.42,50.07 82.03,50.07 82,50.1 | 82.68,44.47 82.49,44.47 82.42,44.53 | 82.42,44.53 82.42,44.68 LED19.4
N$56
  Top 0.813: 87.27,62.73 87,63 | 87.55,50.3 LED18.4 91.3,50.3 94,53 94,60 91.33,62.66 87.58,62.66 87.51,62.73 87.27,62.73 | 87.32,50.3 87.55,50.3 | 87.55,50.3 87.58,50.33 | LED17.3 87.3,62.7 87.27,62.73
N$57
  Top 0.813: 87.58,60.97 88,60.97 | 88,60.97 90.03,60.97 92,59 92,54 90,52 88,52 | 87.32,52 LED18.5 | LED18.5 88,52 | 88,52 87.97,52.03 87.58,52.03 87.58,52.02 LED18.5 | 88,60.97 87.93,61.03 87.03,61.03 87,61 LED17.2
N$58
  Top 0.813: 87.32,53.7 LED18.6 | LED18.6 88,53.7 | 88,53.7 88.7,53.7 90,55 90,58 88.73,59.27 87.58,59.27 87.51,59.34 87.32,59.34 87.32,59.32 LED17.1 | 88,53.7 87.97,53.73 87.58,53.73 87.58,53.72 LED18.6
N$59
  Top 0.813: 82.42,62.53 82,62.53 | 82,62.53 81.27,62.53 80,63.8 80,66.8 81.3,68.1 82.56,68.1 | 82.56,68.1 82.68,68.1 82.68,68.28 LED16.3 | 82.56,68.1 82.45,68.21 | LED17.4 82.17,62.7 82,62.53
N$60
  Top 0.813: 82,60.84 82.6,60.84 82.65,60.79 | 82,60.84 79.97,60.84 78,62.8 78,67.8 80,69.8 82.56,69.8 | 82.56,69.8 82.68,69.8 82.68,69.98 LED16.2 | 82.56,69.8 82.45,69.91 | LED17.5 82.17,61 82,60.84
N$61
  Top 0.813: 82,59.13 82.6,59.13 82.65,59.09 | 82,59.13 78.67,59.13 76,61.8 76,68.8 78.7,71.5 82.68,71.5 82.57,71.61 | 82.45,71.61 82.57,71.61 | LED17.6 82.17,59.3 82,59.13 | 82.57,71.61 LED16.1
N$62
  Top 0.813: 177.32,23.3 181.3,23.3 184,26 184,33 181.34,35.66 177.4,35.66 177.35,35.71 LED40.3 | 177.55,23.19 177.43,23.19 177.32,23.3 | LED41.4 176.7,23.3 177,23 177.02,23 177.32,23.3
N$63
  Top 0.813: 177.44,25 LED41.5 180,25 182,27 182,32 180.03,33.97 177.4,33.97 177.35,34.01 LED40.2 | 177.32,25 177.44,25 | 177.44,25 177.55,24.89
N$64
  Top 0.813: 177.44,26.7 LED41.6 178.7,26.7 180,28 180,31 178.74,32.27 177.58,32.27 177.54,32.3 LED40.1 | 177.32,26.7 177.44,26.7 | 177.44,26.7 177.55,26.59
N$65
  Top 0.813: 172,35.73 172.43,35.73 172.45,35.71 | 172,35.73 171.26,35.73 170,37 170,40 171.3,41.3 LED39.3 172.68,41.3 172.68,41.33 | LED40.4 172.03,35.7 172,35.73
N$66
  Top 0.813: 172,34.03 172.43,34.03 172.45,34.01 | 172,34.03 169.97,34.03 168,36 168,41 170,43 LED39.2 172.68,43 172.68,43.03 | LED40.5 172.03,34 172,34.03
N$67
  Top 0.813: 172,32.34 172.43,32.34 172.45,32.31 | 172,32.34 168.66,32.34 166,35 166,42 168.7,44.7 LED39.1 172.68,44.7 | LED40.6 172.03,32.3 172,32.34
N$68
  Top 0.813: 178,44.7 LED39.6 177.32,44.7 | 178,44.7 178.7,44.7 180,46 180,49 178.74,50.27 177.58,50.27 177.51,50.34 177.32,50.34 177.34,50.31 LED38.1 | 177.58,44.73 177.97,44.73 178,44.7
N$69
  Top 0.813: 177.58,51.97 178,51.97 | 178,51.97 180.03,51.97 182,50 182,45 180,43 178,43 | 177.32,43 LED39.5 178,43 | 177.58,43.03 177.97,43.03 178,43 | 178,51.97 177.93,52.03 177.32,52.03 177.34,52.02 LED38.2
N$70
  Top 0.813: 177.26,53.73 177,54 | 177.55,41.3 LED39.4 181.3,41.3 184,44 184,51 181.34,53.66 177.58,53.66 177.51,53.73 177.26,53.73 | 177.32,41.3 177.55,41.3 | 177.55,41.3 177.58,41.33 | LED38.3 177.3,53.7 177.26,53.73
N$71
  Top 0.813: 172.42,53.73 172,53.73 | 172,53.73 171.26,53.73 170,55 170,58 171.3,59.3 LED37.3 172.68,59.3 | LED38.4 172.03,53.7 172,53.73
N$72
  Top 0.813: 172.68,61 LED37.2 170,61 168,59 168,54 169.97,52.03 172.42,52.03 172.42,52.02 LED38.5
N$73
  Top 0.813: 172.68,62.7 LED37.1 168.7,62.7 166,60 166,53 168.66,50.34 172.42,50.34 172.44,50.31 LED38.6
N$74
  Top 0.254: 177.58,59.3 LED37.4
  Top 0.813: 177.58,59.3 181.3,59.3 184,62 184,69 181.25,71.75 177.33,71.75 177.34,71.74 LED36.3
N$75
  Top 0.254: 177.58,61 LED37.5
  Top 0.813: 177.58,61 180,61 182,63 182,68 179.94,70.06 177.33,70.06 177.34,70.04 LED36.2
N$76
  Top 0.254: 177.58,62.7 LED37.6
  Top 0.813: 177.58,62.7 178.7,62.7 180,64 180,67 179,68 177.68,68 177.34,68.34 | LED36.1 177.34,68.34 | 177.34,68.34 177.33,68.36
N$77
  Top 0.813: LED35.4 141.3,26.7 140,28 140,31 141.3,32.3 LED34.3
N$78
  Top 0.813: 142.44,24.98 LED35.5 139.8,25 138,26.8 138,31.8 140,33.8 142.42,33.8 142.62,34 LED34.2
N$79
  Top 0.813: LED35.6 142.44,23.27 142.67,23.05 138.75,23.05 136,25.8 136,32.8 138.7,35.5 142.42,35.5 142.92,36 143,36 142.7,35.7 LED34.1
N$80
  Top 0.813: 147.55,32.19 147.43,32.19 147.32,32.3 LED34.4 151.3,32.3 154,35 154,42 151.34,44.66 147.4,44.66 147.35,44.71 LED33.3
N$81
  Top 0.813: 147.32,34 147.44,34 | 147.44,34 147.55,33.89 | 147.44,34 LED34.5 150,34 152,36 152,41 150.03,42.97 147.4,42.97 147.35,43.01 LED33.2
N$82
  Top 0.813: 147.7,35.7 148.7,35.7 150,37 150,40 148.74,41.27 147.58,41.27 147.54,41.3 LED33.1 | 147.32,35.7 147.44,35.7 | 147.44,35.7 147.55,35.59 | 147.44,35.7 LED34.6 | LED34.6 147.7,35.7 | 147.7,35.7 148,36 147.86,36 LED34.6
N$83
  Top 0.813: 143,40.8 142.74,41.06 142.49,41.06 142.42,41.13 142,41.13 | 142,41.13 138.66,41.13 136,43.8 136,50.8 138.7,53.5 142.45,53.5 | 142.45,53.5 142.68,53.5 142.68,53.68 LED32.1 | 142.45,53.5 142.42,53.47 | LED33.6 142.16,41.3 142,41.13
N$84
  Top 0.813: 142.42,42.84 142,42.84 | 142,42.84 139.97,42.84 138,44.8 138,49.8 140,51.8 142,51.8 | 142,51.8 142.68,51.8 142.68,51.98 LED32.2 | 142.42,51.77 142.03,51.77 142,51.8 | 142,42.84 142.07,42.77 142.68,42.77 LED33.5
N$85
  Top 0.813: 142.42,44.53 141.26,44.53 140,45.8 140,48.8 141.3,50.1 142,50.1 | 142,50.1 142.68,50.1 142.68,50.28 LED32.3 | 142.42,50.07 142.03,50.07 142,50.1 | 142.68,44.47 142.49,44.47 142.42,44.53 | 142.42,44.53 142.42,44.68 LED33.4
N$86
  Top 0.813: 147.26,62.73 147,63 | 147.55,50.3 LED32.4 151.3,50.3 154,53 154,60 151.34,62.66 147.58,62.66 147.51,62.73 147.26,62.73 | 147.32,50.3 147.55,50.3 | 147.55,50.3 147.58,50.33 | LED31.3 147.3,62.7 147.26,62.73
N$87
  Top 0.813: 147.58,60.97 148,60.97 | 148,60.97 150.03,60.97 152,59 152,54 150,52 148,52 | 147.32,52 LED32.5 | LED32.5 148,52 | 148,52 147.97,52.03 147.58,52.03 147.58,52.02 LED32.5 | 148,60.97 147.93,61.03 147.03,61.03 147,61 LED31.2
N$88
  Top 0.813: LED31.1 148.7,59.3 150,58 150,55 148.7,53.7 LED32.6
N$89
  Top 0.813: LED30.3 141.3,68.3 140,67 140,64 141.3,62.7 LED31.4
N$90
  Top 0.813: LED31.5 140,61 138,63 138,68 140,70 LED30.2
N$91
  Top 0.813: 142,59.13 142.6,59.13 142.65,59.09 | 142,59.13 138.66,59.13 136,61.8 136,68.8 138.7,71.5 142.68,71.5 142.57,71.61 | 142.45,71.61 142.57,71.61 | LED31.6 142.16,59.3 142,59.13 | 142.57,71.61 LED30.1
N$92
  Top 1.93: LED29.A 68.64,11.72 70.8,9.56 LED22.C
N$93
  Top 1.93: LED22.A 97.56,11.8 99.86,9.5 LED15.C
N$94
  Top 1.93: LED8.C 129.76,9.47 127.5,11.74 LED15.A
N$95
  Top 1.93: LED8.A 158.65,11.71 160.83,9.54 LED7.C
N$96
  Bottom 0.61: U4.6 U4.5
  Bottom 0.813: L4.1 22.21,17.67 23.11,16.76 | 23.11,16.76 U4.5 | D4.A 22.35,21.59 23.11,20.83 23.11,16.76
N$97  (2 unrouted)
N$98
  Bottom 0.406: U6.14 139.66,49.66 R33.2
N$99
  Bottom 0.406: U6.11 134.07,53.66 134.07,56.06 R32.2
N$100
  Bottom 0.254: U6.7 122.81,49.66 120.65,51.82 119.72,51.82 R31.2
N$101
  Bottom 0.406: U6.4 119.04,45.85 R30.2
N$102
  Bottom 0.406: U6.15 136.27,48.39 138.68,45.97 139.79,45.97 R29.2
N$103
  Bottom 0.406: U6.16 135.76,47.12 138.43,44.45 138.43,42.67 138.85,42.25 R28.2
N$104
  Bottom 0.406: U6.3 122.17,44.58 121.41,43.81 R27.2
N$105  (3 unrouted)
N$106  (via drill 0.61)
  Top 0.305: v60.96,38.73 55.88,38.73 54.99,37.85 54.99,32.13 52.07,29.21 27.18,29.21 25.65,27.69 v25.65,15.37
  Bottom 0.305: 64.77,38.73 v60.96,38.73 | v25.65,15.37 26.92,14.1 U4.8 26.92,11.05 26.04,10.16 20.32,10.16 19.05,8.89 D5.3
  Bottom 0.406: R21.2 65.02,38.99 64.77,38.73
N$107  (2 unrouted)
N$114
  Bottom 0.254: Q3.1 98.99,25.71 97.92,24.64 97.92,23.99 U3.1
N$115
  Bottom 0.254: Q3.3 106.53,24.77 L3.1
N$116
  Bottom 0.254: U3.20 97.45,25.31 98.81,26.67 106.93,26.67 | L3.2 107.95,26.82 106.53,26.82 106.05,27.3
  Bottom 0.813: D3.A 104.78,27.3 105.41,26.67 106.93,26.67 107.81,26.67 107.95,26.82
N$117
  Bottom 0.254: U3.16 94.76,23.86 93.94,24.68 R23.2 | C31.2 93.94,36.15 C32.1
  Bottom 0.305: R23.2 R22.1 C31.2
N$118
  Bottom 0.254: R20.2 C27.1 97.79,28.57 96.45,27.23 U3.18
N$119
  Bottom 0.254: R20.1 C29.1
N$120
  Bottom 0.254: U3.8 96.95,19.48 94.93,17.46 94.93,14.29 95.89,12.7 R18.2
N$121
  Bottom 0.254: U3.17 95.95,28.64 97.16,29.84 R17.2
N$122
  Bottom 0.254: 157.61,24.64 157.61,23.99 U1.1
  Bottom 0.305: Q1.1 158.68,25.71 157.61,24.64
N$125
  Bottom 0.254: Q1.3 166.22,24.77 L1.1
N$126
  Bottom 0.254: L1.2 167.64,26.82 166.22,26.82 165.74,27.3
  Bottom 0.305: U1.20 157.14,25.31 158.5,26.67 165.35,26.67
  Bottom 0.813: D1.A 164.47,27.3 165.1,26.67 165.35,26.67 167.5,26.67 167.64,26.82
N$127
  Bottom 0.254: U1.16 154.71,23.86 | C12.2 153.88,36.15 C13.1
  Bottom 0.305: C12.2 R11.1 R12.2 153.88,24.68 154.71,23.86
N$128
  Bottom 0.254: U1.18 156.14,27.49 157.48,28.83 C7.1
  Bottom 0.305: C7.1 R9.2
N$129
  Bottom 0.305: R9.1 C10.1
N$130
  Bottom 0.305: U1.8 156.64,19.48 154.62,17.46 154.62,14.03 155.7,12.95 R6.2
N$131
  Bottom 0.254: C23.2 100.33,15.03 | 100.33,15.03 R15.2 R16.2 | U3.4 100.07,22.36 100.58,21.84 100.58,16.51 100.33,16.26 100.33,15.03
N$133
  Bottom 0.305: U1.17 155.64,28.64 156.84,29.84 R5.2
N$134
  Bottom 0.254: C1.2 160.27,15.03 | 160.27,15.03 R1.2 R2.2 | U1.4 159.51,22.36 161.04,20.83 161.04,18.29 160.02,17.27 160.02,15.28 160.27,15.03
N$138
  Bottom 0.254: Q2.1 37.4,25.71 36.32,24.64 36.32,23.99 U2.1
N$139
  Bottom 0.305: U5.1 83.37,56.7 83.82,57.15 83.82,58.42 | 83.82,58.42 83.82,58.59 | R25.2 83.61,58.63 83.82,58.42
N$140
  Bottom 0.254: Q2.3 44.94,24.77 L2.1
N$141
  Bottom 0.254: U2.20 35.85,25.18 37.34,26.67 44.2,26.67 | L2.2 46.35,26.82 44.94,26.82 44.45,27.3
  Bottom 0.813: D2.A 43.18,27.3 43.81,26.67 44.2,26.67 46.21,26.67 46.35,26.82
N$142
  Bottom 0.254: U2.16 33.42,23.86 32.6,24.68 R14.2 | C18.2 32.6,36.15 C19.1
  Bottom 0.305: R14.2 R13.1 C18.2
N$143
  Bottom 0.254: R10.2 C8.1 36.2,28.57 34.85,27.23 U2.18
N$144
  Bottom 0.254: R10.1 C15.1
N$145
  Bottom 0.254: U2.8 35.35,19.48 33.34,17.46 33.34,14.29 34.29,12.7 R8.2
N$146
  Bottom 0.254: U2.17 34.35,28.64 35.56,29.84 R7.2
N$147
  Bottom 0.254: C2.2 38.61,15.03 | 38.61,15.03 R3.2 R4.2 | U2.4 38.48,22.36 39.24,21.59 39.24,18.41 38.61,17.78 38.61,15.03
NRST
  Bottom 0.254: 80.26,58.32 R24.1
  Bottom 0.305: U5.4 80.63,54.75 80.26,55.12 80.26,56.64 | 80.26,56.64 80.26,58.32 | JP1.1 67.3,48.53 65.53,50.29 65.53,56.39 66.55,57.4 79.5,57.4 80.26,56.64
POWER_LED+  (via drill 0.61)
  Top 0.61: v16,2.29 15.49,2.54
  Top 1.93: LED7.A 185.07,11.78 186.94,9.91 186.94,4.32 185.42,2.54 15.49,2.54
  Bottom 0.61: 27.09,5.37 U4.1 | D4.C 14.48,21.59
  Bottom 0.813: R19.1 27.09,5.37 | 14.48,21.59 12.95,20.07 12.95,5.33 v16,2.29 25.65,2.29 26.92,3.56 U4.1
POWER_LED-  (via drill 0.61)
  Top 0.61: LED42.C 15.64,9.51 v15.49,9.65
  Bottom 0.61: v15.49,9.65 15.49,11.41 L4.2
PWM1  (via drill 0.61)
  Top 0.254: v157.73,62.48 159.77,60.45 v159.77,18.8 | v103.89,51.05 103.89,63.5 104.39,64.01 v105.41,64.01
  Bottom 0.254: U1.5 159.23,21.86 159.75,21.34 159.75,19.32 v159.77,18.8 | U5.6 91.33,53.45 93.98,50.8 103.63,50.8 v103.89,51.05 | v157.73,62.48 156.21,64.01 v105.41,64.01
PWM2  (via drill 0.61)
  Top 0.254: v85.09,34.04 85.09,21.59 84.33,20.83 38.35,20.83 v38.1,21.08
  Bottom 0.254: U5.10 84.53,50.85 85.09,50.29 v85.09,34.04 | 37.85,21.34 v38.1,21.08 37.34,21.84 36.46,21.84 U2.5
PWM3  (via drill 0.61)
  Top 0.254: 99.57,21.08 v99.57,21.34 v95,25.91 | v95.25,32.51 94.74,33.02 94.74,48.01 v94.23,48.51
  Bottom 0.254: U5.8 90.6,52.15 v94.23,48.51 | U3.5 99.05,21.86 v99.57,21.34 | v95,25.91 95,32.51 v95.25,32.51
PWM4
  Bottom 0.305: U5.13 74.75,52.15 | 74.75,52.11 R21.1
  Bottom 0.406: 74.75,52.15 74.75,52.11
R1  (via drill 0.61)
  Top 0.254: LED41.3 167.83,23.3 163.07,18.54 v163.07,18.03
  Bottom 0.305: v163.07,18.03 163.07,17.53 163.07,13.72 160.27,10.92 155.7,10.92 153.42,13.21 153.42,18.03 155.64,20.25 U1.10
R2  (via drill 0.61)
  Top 0.254: v151.76,22.23 151.76,26.04 151.13,26.67 147.37,26.67 LED35.3
  Bottom 0.254: U1.11 152.63,21.36 v151.76,22.23
R3  (via drill 0.61)
  Top 0.254: v114.94,23.5 112.85,23.5 LED28.3
  Bottom 0.254: U1.12 154.04,21.86 151.13,24.77 116.2,24.77 v114.94,23.5
R4  (via drill 0.61)
  Top 0.254: LED21.3 92.49,26.7 93.73,27.94 117.35,27.94 v118.11,28.45
  Bottom 0.254: U1.13 154.17,22.36 147.32,29.21 118.87,29.21 v118.11,28.45
R5  (via drill 0.61)
  Top 0.254: LED14.3 52.98,22.86 55.12,22.86 55.75,23.5 55.75,28.57 56.64,29.46 v58.29,29.46 | v116.59,29.21 88.14,29.21 v87.38,28.45
  Bottom 0.254: U1.14 154.31,22.86 147.32,29.84 117.22,29.84 v116.59,29.21 | v87.38,28.45 68.33,28.45 67.31,29.46 v58.29,29.46
R6  (via drill 0.61)
  Top 0.254: 27.31,26.67 LED6.3 29.22,28.57 52.45,28.57 54.36,30.48 v56.39,30.48 | v87.38,30.48 117.86,30.48 v118.11,30.73
  Bottom 0.254: U1.15 154.44,23.36 147.32,30.48 118.36,30.48 v118.11,30.73 | v87.38,30.48 v56.39,30.48
R+  (via drill 0.61)
  Top 0.254: LED23.4 112.44,71.74 112.43,71.75
  Top 0.813: LED1.4 25.7,68.3 25,69 25,73 26,74 54,74 | LED9.4 52.48,71.7 52.48,72.48 54,74 | LED16.4 85.7,68.3 85,69 85,73 86,74 | 112.48,71.7 112.43,71.75 112.43,72.43 114,74 | 54,74 86,74 | 86,74 114,74 | 114,74 146,74 | 146,74 170.14,74 LED36.4 | 146,74 145,73 145,69 145.7,68.3 LED30.4 155.85,68.3 v160.02,64.14
  Bottom 0.254: 149.65,31.11 C9.1 | 160.87,41.7 160.66,41.91 C20.+ | 154.94,40.64 154.94,41.75 C16.+
  Bottom 0.813: 149.65,31.11 R11.2 C12.1 152.19,37.88 154.94,40.64 | D1.C 164.47,34.92 163.19,36.2 C11.1 160.87,41.7 | C16.+ C20.+ 159.86,63.98 v160.02,64.14
SCL  (via drill 0.61)
  Top 0.305: v120.65,57.66 131.57,57.66 v131.83,57.4
  Bottom 0.305: U6.18 132.97,44.58 131.83,45.72 v131.83,57.4 | U5.3 119.92,55.4 120.65,56.13 v120.65,57.66
SCL1  (via drill 0.61)
  Top 0.254: v157.48,18.8 157.48,48.77 v155.45,50.8
  Bottom 0.254: U6.13 134.39,50.8 v155.45,50.8
  Bottom 0.305: R2.1 156.21,17.53 v157.48,18.8 157.48,19.56 157.14,19.9 U1.7
SCL2  (via drill 0.61)
  Top 0.254: v35.31,18.03 35.56,18.03 35.81,17.78 52.58,17.78 v53.09,18.29
  Bottom 0.254: R4.1 34.92,17.65 v35.31,18.03 35.31,17.78 35.85,18.33 U2.7 | v53.09,18.29 53.09,60.45 54.86,62.23 119.63,62.23 121.67,60.2 121.67,53.85 123.32,52.2 U6.9
SCL3  (via drill 0.61)
  Top 0.254: v97.54,18.54 97.79,18.54 98.04,18.29 113.54,18.29 v114.05,18.8
  Bottom 0.254: U3.7 97.45,18.71 97.54,18.62 v97.54,18.54 96.52,17.53 R16.1 | v114.05,18.8 114.05,47.75 114.68,48.39 U6.6
SDA  (via drill 0.61)
  Top 0.305: v119.13,56.39 130.3,56.39 v130.56,56.13
  Bottom 0.305: U6.19 132.97,43.31 131.06,45.21 131.06,55.63 v130.56,56.13 | U5.2 118.79,56.05 v119.13,56.39
SDA1  (via drill 0.61)
  Top 0.254: v156.97,52.07 158.5,50.55 v158.5,20.32
  Bottom 0.254: U1.6 158.35,21.36 158.5,21.2 158.5,21.08 v158.5,20.32 | U6.12 156.84,52.2 v156.97,52.07
  Bottom 0.305: R1.1 158.75,20.32 v158.5,20.32
SDA2  (via drill 0.61)
  Top 0.254: v36.83,18.8 v51.56,18.8
  Bottom 0.254: R3.1 37.47,18.41 v36.83,18.8 36.83,21.34 36.47,21.34 U2.6 | v51.56,18.8 51.56,61.21 53.34,62.99 120.4,62.99 127.25,56.13 127.25,52.07 126.24,51.05 125.19,51.05 U6.8
SDA3  (via drill 0.61)
  Top 0.254: v98.81,19.05 v112.52,19.05 | v115.06,46.74 v112.27,46.74
  Bottom 0.254: U3.6 98.41,21.36 98.81,20.95 v98.81,19.05 99.06,18.8 R15.1 | U6.5 116.71,47.12 | v112.52,19.05 112.52,46.48 v112.27,46.74
  Bottom 0.305: 116.71,47.12 115.19,47.12 v115.06,46.74
TCK
  Bottom 0.254: U5.20 68.81,56.7 JP1.4
TMS
  Bottom 0.254: U5.19 71.03,56.05 69.85,54.86 66.55,54.86 66.04,54.36 66.04,52.07 67.06,51.05 68.25,51.05 JP1.2

## Text on the board
bNames: CANH | CANL | +24V | GND